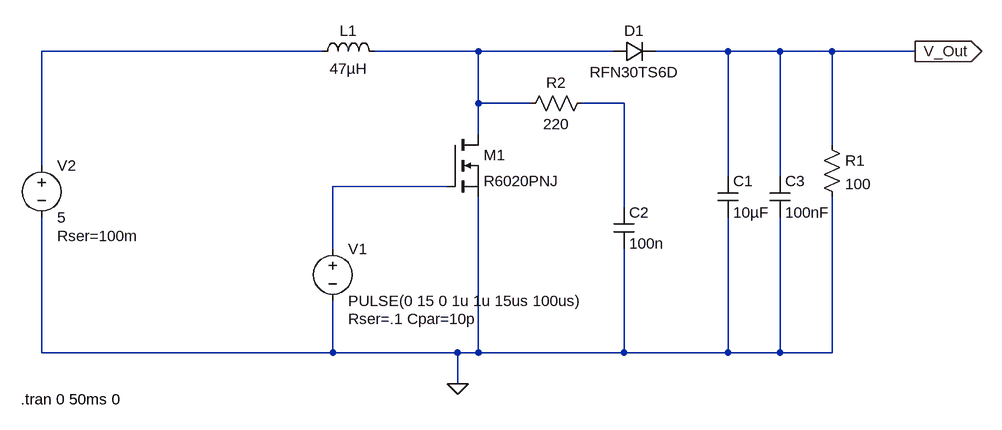
[diagram p0: schematic boost.asc]
boost.asc, the LTspice schematic file:
Version 4
SHEET 1 1012 680
WIRE -32 0 -464 0
WIRE 208 0 48 0
WIRE 416 0 208 0
WIRE 592 0 480 0
WIRE 672 0 592 0
WIRE 752 0 672 0
WIRE 880 0 752 0
WIRE 208 80 208 0
WIRE 288 80 208 80
WIRE 432 80 368 80
WIRE 208 128 208 80
WIRE 752 144 752 0
WIRE -464 176 -464 0
WIRE 592 192 592 0
WIRE 672 192 672 0
WIRE 160 208 -16 208
WIRE 432 240 432 80
WIRE -16 304 -16 208
WIRE -464 464 -464 256
WIRE -16 464 -16 384
WIRE -16 464 -464 464
WIRE 176 464 -16 464
WIRE 208 464 208 224
WIRE 208 464 176 464
WIRE 432 464 432 304
WIRE 432 464 208 464
WIRE 592 464 592 256
WIRE 592 464 432 464
WIRE 672 464 672 256
WIRE 672 464 592 464
WIRE 752 464 752 224
WIRE 752 464 672 464
WIRE 176 512 176 464
FLAG 176 512 0
FLAG 880 0 V_Out
IOPIN 880 0 Out
SYMBOL nmos 160 128 R0
SYMATTR InstName M1
SYMATTR Value R6020PNJ
SYMBOL ind -48 16 R270
WINDOW 0 32 56 VTop 2
WINDOW 3 5 56 VBottom 2
SYMATTR InstName L1
SYMATTR Value 47µH
SYMATTR SpiceLine Cpar=5n
SYMBOL diode 416 16 R270
WINDOW 0 32 32 VTop 2
WINDOW 3 0 32 VBottom 2
SYMATTR InstName D1
SYMATTR Value RFN30TS6D
SYMBOL res 736 128 R0
SYMATTR InstName R1
SYMATTR Value 100
SYMBOL voltage -16 288 R0
WINDOW 123 0 0 Left 0
WINDOW 39 24 124 Left 2
SYMATTR SpiceLine Rser=.1 Cpar=10p
SYMATTR InstName V1
SYMATTR Value PULSE(0 15 0 1u 1u 15us 100us)
SYMBOL voltage -464 160 R0
WINDOW 123 0 0 Left 0
WINDOW 39 24 124 Left 2
SYMATTR SpiceLine Rser=100m
SYMATTR InstName V2
SYMATTR Value 5
SYMBOL cap 576 192 R0
SYMATTR InstName C1
SYMATTR Value 10µF
SYMBOL res 384 64 R90
WINDOW 0 0 56 VBottom 2
WINDOW 3 32 56 VTop 2
SYMATTR InstName R2
SYMATTR Value 220
SYMBOL cap 416 240 R0
SYMATTR InstName C2
SYMATTR Value 100n
SYMBOL cap 656 192 R0
SYMATTR InstName C3
SYMATTR Value 100nF
TEXT -496 536 Left 2 !.tran 0 50ms 0

The netlist it stands for:
* boost.asc
M1 N002 N004 0 0 R6020PNJ
L1 N001 N002 47µH Cpar=5n
D1 N002 V_Out RFN30TS6D
R1 V_Out 0 100
V1 N004 0 PULSE(0 15 0 1u 1u 15us 100us) Rser=.1 Cpar=10p
V2 N001 0 5 Rser=100m
C1 V_Out 0 10µF
R2 N003 N002 220
C2 N003 0 100n
C3 V_Out 0 100nF
.model D D
.lib standard.dio
.model NMOS NMOS
.model PMOS PMOS
.lib standard.mos
.tran 0 50ms 0
.backanno
.end